# EAGLE schematic Pure VCF (EAGLE 8.3.0)
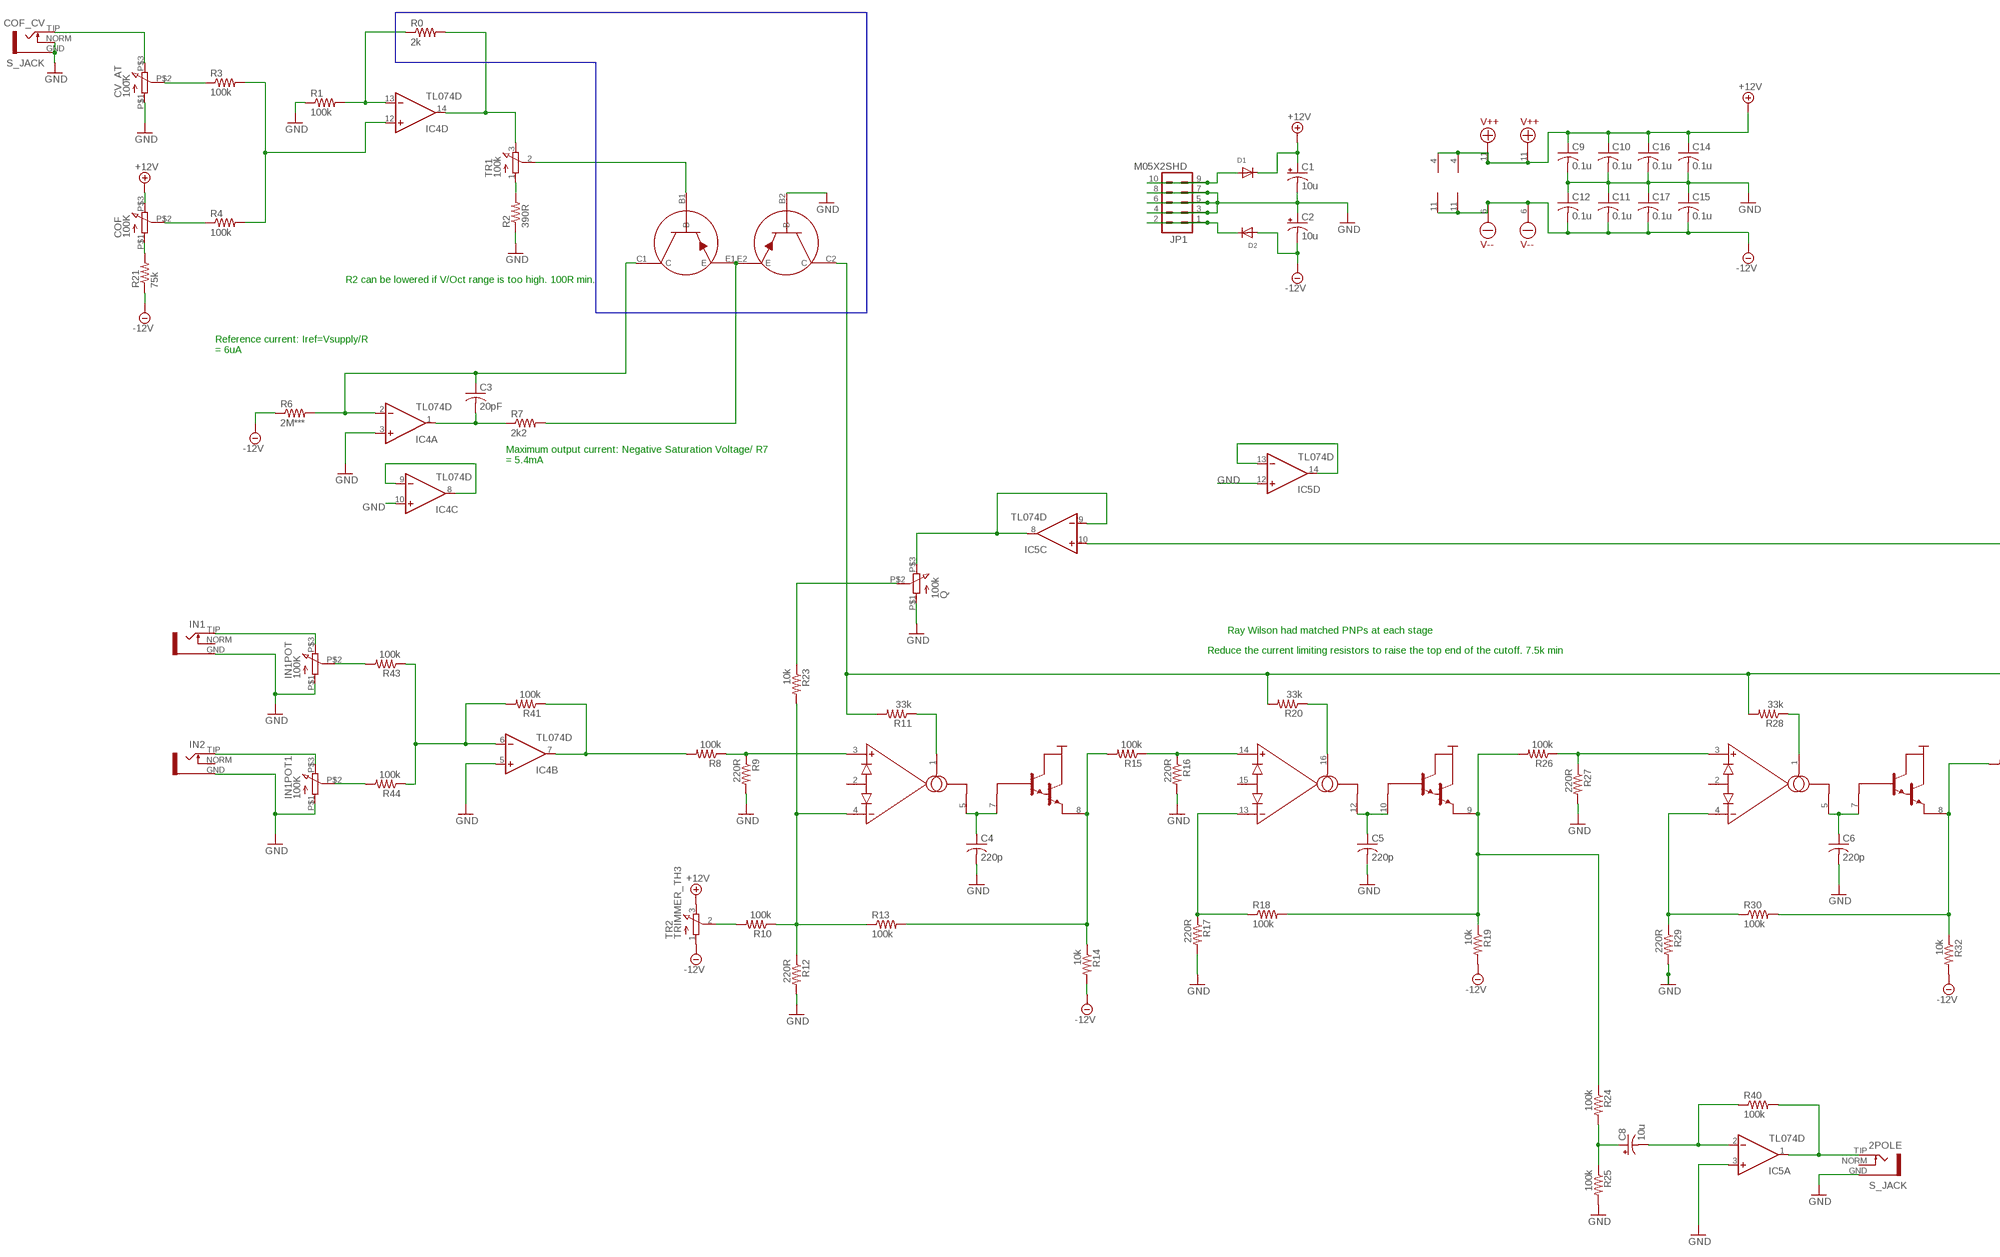
[diagram p0: schematic, sheet 1, part 1 of 2]
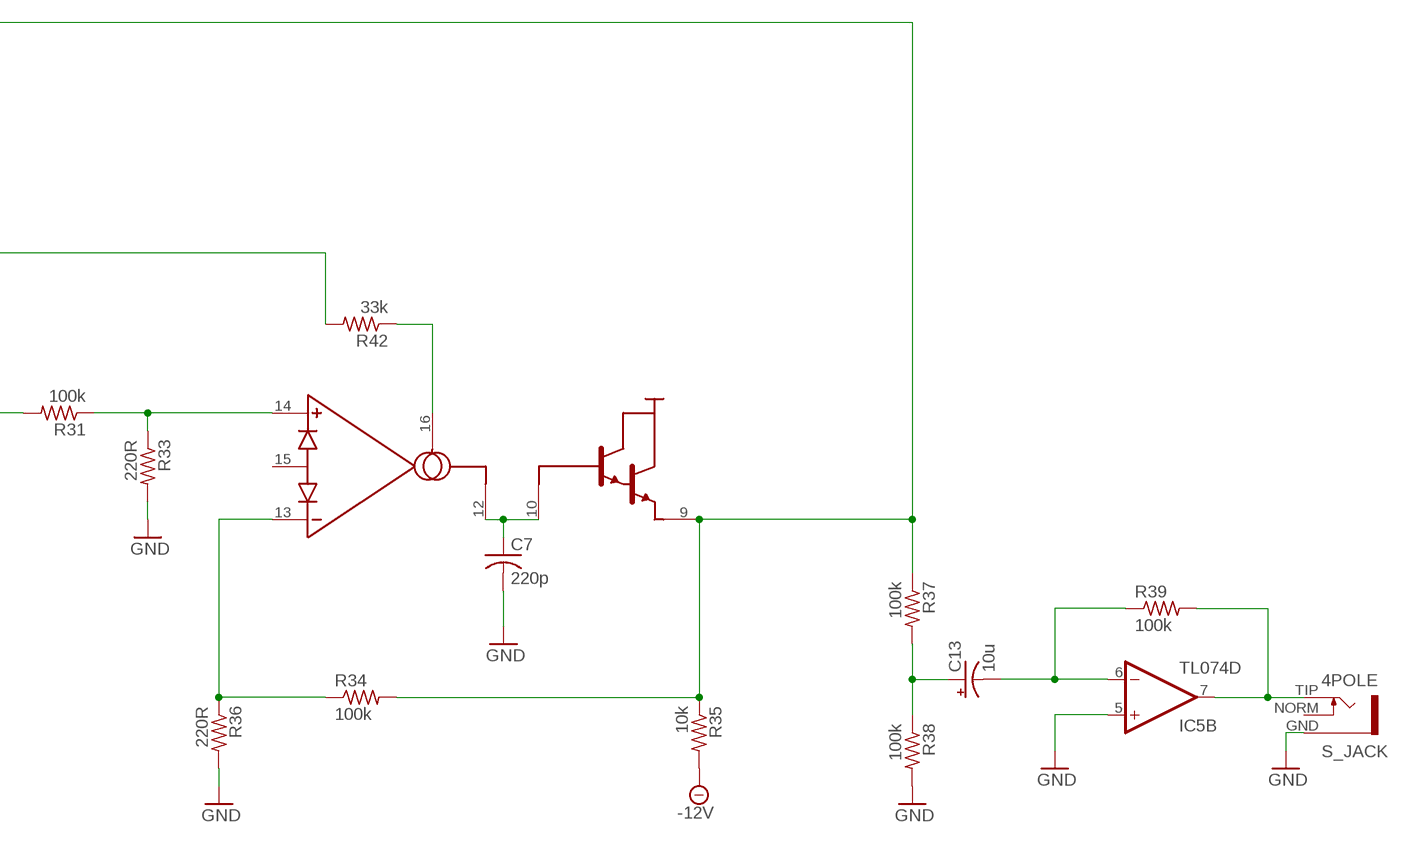
[diagram p1: schematic, sheet 1, part 2 of 2]

## Parts
2POLE  S_JACK  [S_JACK]
4POLE  S_JACK  [S_JACK]
C1  10u  CPOL-US153CLV-0505  [153CLV-0505]
C2  10u  CPOL-US153CLV-0505  [153CLV-0505]
C3  20pF  C-USC0805K  [C0805K]
C4  220p  C-US050-045X075  [C050-045X075]
C5  220p  C-US050-045X075  [C050-045X075]
C6  220p  C-US050-045X075  [C050-045X075]
C7  220p  C-US050-045X075  [C050-045X075]
C8  10u  CPOL-US153CLV-0505  [153CLV-0505]
C9  0.1u  C-USC0805K  [C0805K]
C10  0.1u  C-USC0805K  [C0805K]
C11  0.1u  C-USC0805K  [C0805K]
C12  0.1u  C-USC0805K  [C0805K]
C13  10u  CPOL-US153CLV-0505  [153CLV-0505]
C14  0.1u  C-USC0805K  [C0805K]
C15  0.1u  C-USC0805K  [C0805K]
C16  0.1u  C-USC0805K  [C0805K]
C17  0.1u  C-USC0805K  [C0805K]
COF  100K  9MMPOT  [POT]
COF_CV  S_JACK  [S_JACK]
CV_AT  100K  9MMPOT  [POT]
D1  DIODESMA  [SMADIODE]
D2  DIODESMA  [SMADIODE]
IC4  TL074D  [SO14]
IC5  TL074D  [SO14]
IN1  S_JACK  [S_JACK]
IN1POT  100K  9MMPOT  [POT]
IN1POT1  100K  9MMPOT  [POT]
IN2  S_JACK  [S_JACK]
JP1  M05X2SHD  [2X5-SHROUDED]
Q  100k  9MMPOT  [POT]
R0  2k  R_TC  [RESISTOR_TC]
R1  100k  R-US_R0805  [R0805]
R2  390R  R-US_R0805  [R0805]
R3  100k  R-US_R0805  [R0805]
R4  100k  R-US_R0805  [R0805]
R6  2M***  R-US_R0805  [R0805]
R7  2k2  R-US_R0805  [R0805]
R8  100k  R-US_R0805  [R0805]
R9  220R  R-US_R0805  [R0805]
R10  100k  R-US_R0805  [R0805]
R11  33k  R-US_R0805  [R0805]
R12  220R  R-US_R0805  [R0805]
R13  100k  R-US_R0805  [R0805]
R14  10k  R-US_R0805  [R0805]
R15  100k  R-US_R0805  [R0805]
R16  220R  R-US_R0805  [R0805]
R17  220R  R-US_R0805  [R0805]
R18  100k  R-US_R0805  [R0805]
R19  10k  R-US_R0805  [R0805]
R20  33k  R-US_R0805  [R0805]
R21  75k  R-US_R0805  [R0805]
R23  10k  R-US_R0805  [R0805]
R24  100k  R-US_R0805  [R0805]
R25  100k  R-US_R0805  [R0805]
R26  100k  R-US_R0805  [R0805]
R27  220R  R-US_R0805  [R0805]
R28  33k  R-US_R0805  [R0805]
R29  220R  R-US_R0805  [R0805]
R30  100k  R-US_R0805  [R0805]
R31  100k  R-US_R0805  [R0805]
R32  10k  R-US_R0805  [R0805]
R33  220R  R-US_R0805  [R0805]
R34  100k  R-US_R0805  [R0805]
R35  10k  R-US_R0805  [R0805]
R36  220R  R-US_R0805  [R0805]
R37  100k  R-US_R0805  [R0805]
R38  100k  R-US_R0805  [R0805]
R39  100k  R-US_R0805  [R0805]
R40  100k  R-US_R0805  [R0805]
R41  100k  R-US_R0805  [R0805]
R42  33k  R-US_R0805  [R0805]
R43  100k  R-US_R0805  [R0805]
R44  100k  R-US_R0805  [R0805]
T1  TRANS_PAIR_PNP  [TRANS_PAIR]
TR1  100k  TRIMMER_TH3  [TRIMMER_TH3]
TR2  TRIMMER_TH3  [TRIMMER_TH3]
U$3  LM13700  [SOIC-16_BLANK]
U$4  LM13700  [SOIC-16_BLANK]

## Nets
+12V: C1.+ C9.1 C10.1 C14.1 C16.1 COF.P$3 D1.C IC4.4(P:V+) IC5.4(P:V+) TR2.3 U$3.11(V++) U$4.11(V++)
-12V: C2.- C11.2 C12.2 C15.2 C17.2 D2.A IC4.11(P:V-) IC5.11(P:V-) R6.1 R14.2 R19.2 R21.1 R32.2 R35.2 TR2.1 U$3.6(V--) U$4.6(V--)
GND: 2POLE.GND 4POLE.GND C1.- C2.+ C4.2 C5.2 C6.2 C7.2 C9.2 C10.2 C11.1 C12.1 C14.2 C15.1 C16.2 C17.1 COF_CV.GND COF_CV.NORM CV_AT.P$1 IC4.3(A:+IN) IC4.5(B:+IN) IC4.10(C:+IN) IC5.3(A:+IN) IC5.5(B:+IN) IC5.12(D:+IN) IN1.GND IN1POT1.P$1 IN1POT.P$1 IN2.GND JP1.3 JP1.4 JP1.5 JP1.6 JP1.7 JP1.8 Q.P$1 R1.1 R2.1 R9.2 R12.2 R16.2 R17.2 R25.2 R27.2 R29.2 R33.2 R36.2 R38.2 T1.B2(B)
N$1: C5.1 U$3.10(BUF-IN_2) U$3.12(OUT)
N$2: T1.B1(B) TR1.2
N$3: R2.2 TR1.1
N$4: R10.1 R12.1 R13.1 R23.2 U$3.4(IN-)
N$5: IC4.14(D:OUT) R0.2 TR1.3
N$6: IC4.13(D:-IN) R0.1 R1.2
N$7: COF_CV.TIP CV_AT.P$3
N$8: IC4.12(D:+IN) R3.2 R4.2
N$9: CV_AT.P$2 R3.1
N$10: COF.P$2 R4.1
N$11: C3.1 IC4.2(A:-IN) R6.2 T1.C1(C)
N$12: C3.2 IC4.1(A:OUT) R7.1
N$13: R11.1 U$3.1(BIAS-IN)
N$14: R7.2 T1.E1(E) T1.E2(E)
N$15: IC4.6(B:-IN) R41.2 R43.1 R44.1
N$16: R18.2 R19.1 R24.1 R26.2 U$3.9(BUF-OUT_2)
N$17: R8.1 R9.1 U$3.3(IN+)
N$18: C8.- IC5.2(A:-IN) R40.1
N$19: Q.P$2 R23.1
N$20: IC5.8(C:OUT) IC5.9(C:-IN) Q.P$3
N$21: C13.- IC5.6(B:-IN) R39.1
N$22: R20.1 U$3.16(BIAS-IN)
N$23: R15.1 R16.1 U$3.14(IN+)
N$24: R17.1 R18.1 U$3.13(IN-)
N$25: COF.P$1 R21.2
N$26: C8.+ R24.2 R25.1
N$27: C4.1 U$3.5(OUT) U$3.7(BUF-IN_2)
N$28: R13.2 R14.1 R15.2 U$3.8(BUF-OUT_2)
N$29: R26.1 R27.1 U$4.3(IN+)
N$30: 2POLE.TIP IC5.1(A:OUT) R40.2
N$31: R42.1 U$4.16(BIAS-IN)
N$32: IC4.7(B:OUT) R8.2 R41.1
N$33: R29.1 R30.1 U$4.4(IN-)
N$35: R11.2 R20.2 R28.2 R42.2 T1.C2(C)
N$36: C13.+ R37.2 R38.1
N$37: IC5.13(D:-IN) IC5.14(D:OUT)
N$38: D1.A JP1.9 JP1.10
N$39: IC4.8(C:OUT) IC4.9(C:-IN)
N$40: R34.1 R36.1 U$4.13(IN-)
N$41: 4POLE.TIP IC5.7(B:OUT) R39.2
N$43: R31.1 R33.1 U$4.14(IN+)
N$44: R30.2 R31.2 R32.1 U$4.8(BUF-OUT_2)
N$46: IC5.10(C:+IN) R34.2 R35.1 R37.1 U$4.9(BUF-OUT_2)
N$47: IN1.TIP IN1POT.P$3
N$49: IN1POT1.P$3 IN2.TIP
N$50: D2.C JP1.1 JP1.2
N$53: IN1POT.P$2 R43.2
N$54: R10.2 TR2.2
N$55: IN1POT1.P$2 R44.2
N$57: C6.1 U$4.5(OUT) U$4.7(BUF-IN_2)
N$58: C7.1 U$4.10(BUF-IN_2) U$4.12(OUT)
N$59: R28.1 U$4.1(BIAS-IN)
Unconnected: 2POLE.NORM 4POLE.NORM IN1.NORM IN2.NORM U$3.2(D-BIAS) U$3.15(D-BIAS) U$4.2(D-BIAS) U$4.15(D-BIAS)

## Buses
B$1

## Notes on the sheet
- R2 can be lowered if V/Oct range is too high. 100R min.
- Reference current: Iref=Vsupply/R
  = 6uA
- Maximum output current: Negative Saturation Voltage/ R7
  = 5.4mA
- Ray Wilson had matched PNPs at each stage
- Reduce the current limiting resistors to raise the top end of the cutoff. 7.5k min

## Library data of the parts
2POLE 4POLE COF_CV = GMSN:S_JACK
C1 C2 = rcl:CPOL-US: POLARIZED CAPACITOR, American symbol
C3 = GMSN:C-US: CAPACITOR, American symbol
C4-C7 C9-C12 C14-C17 = rcl:C-US: CAPACITOR, American symbol
C8 C13 = GMSN:CPOL-US: POLARIZED CAPACITOR, American symbol
COF CV_AT IN1POT IN1POT1 Q = GMSN:9MMPOT
D1 D2 = adafruit:DIODE: Diode SMADIODE - SMA Surface Mount Package 20V 1A Schottky Diode Digikey: 641-1014-6-ND DO-1N4148 - Through Hole Small Current Diode SOD-123 20V 1 A (.5mV Vf) Schottky Diode - Digikey: MBRX120TPMSCT-ND SOD-323 10V 570mA (.38mV Vf, 3ns) Schottky Diode - Digikey: ZLLS410CT-ND SOD-523 30V 30mA Schottky Diode (RB751S-40TE61) - Digikey: RB751S-40TE61CT-ND SOT23-R/W - SOT23 Package (R = Solder Paste/Reflow Ovens, W = Hand-Soldering) BAT54Film 40V 300mA - Digikey: 497-7162-1-ND
IC4 IC5 = GMSN:TL074: OP AMP
IN1 IN2 = INSTRUO:S_JACK
JP1 = SparkFun-Connectors:M05X2: Header 5x2 Standard 10-pin dual row 0.1" header. Commonly used with AVR-ISP. Use with Spark Fun Electronics SKU: PRT-00778
R0 = INSTRUO:R_TC
R1-R4 R6-R20 R23-R44 = GMSN:R-US_: RESISTOR, American symbol
R21 = rcl:R-US_: RESISTOR, American symbol
T1 = GMSN:TRANS_PAIR_PNP
TR1 TR2 = GMSN:TRIMMER_TH3
U$3 U$4 = GMSN:LM13700